# Altium schematic sheet praline.SchDoc
size 297 x 209 mm
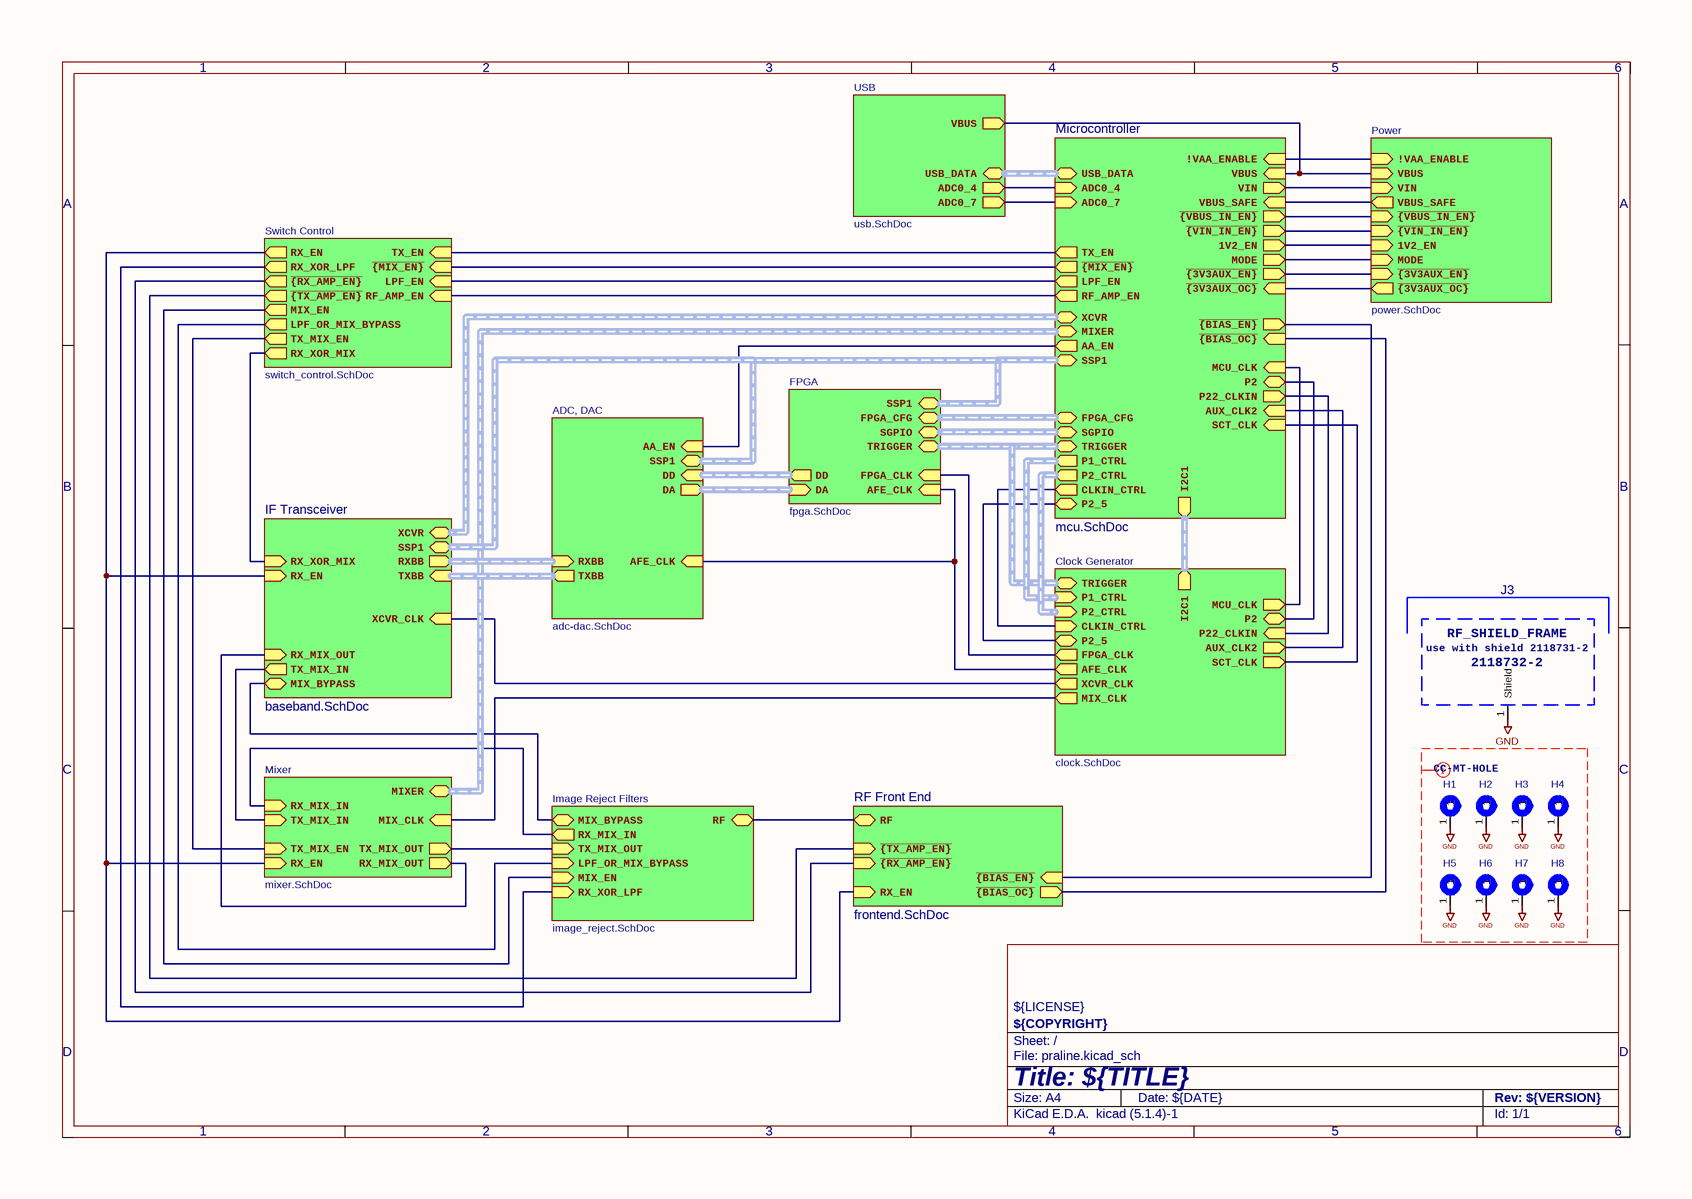
[diagram p0: praline.SchDoc]

## Parts
H1  MountingHole_Pad  [MountingHole_3.2mm_M3_Pad_Via]  (value not drawn)
H2  MountingHole_Pad  [MountingHole_3.2mm_M3_Pad_Via]  (value not drawn)
H3  MountingHole_Pad  [MountingHole_3.2mm_M3_Pad_Via]  (value not drawn)
H4  MountingHole_Pad  [MountingHole_3.2mm_M3_Pad_Via]  (value not drawn)
H5  MountingHole_Pad  [MountingHole_2.2mm_M2_Pad_Via]  (value not drawn)
H6  MountingHole_Pad  [MountingHole_2.2mm_M2_Pad_Via]  (value not drawn)
H7  MountingHole_Pad  [MountingHole_2.2mm_M2_Pad_Via]  (value not drawn)
H8  MountingHole_Pad  [MountingHole_2.2mm_M2_Pad_Via]  (value not drawn)
J3  Part Number: 2118732-2  Note: use with shield 2118731-2  [Laird_Technologies_BMI-S-230-F_50.8x38.1mm]  (hidden comment: RF_SHIELD_FRAME)

## Sub-sheets
ADC, DAC = adc-dac.SchDoc: AFE_CLK (in), RXBB (in, harness RXBB), TXBB (out, harness TXBB), DD (in, harness DD), DA (out, harness DA), AA_EN (in), SSP1 (bidir, harness SSP1)
Clock Generator = clock.SchDoc: MCU_CLK (out), AFE_CLK (out), MIX_CLK (out), XCVR_CLK (out), TRIGGER (bidir, harness TRIGGER), SCT_CLK (out), FPGA_CLK (out), P2_5 (bidir), AUX_CLK2 (out), P1_CTRL (in, harness P1_CTRL), P22_CLKIN (in), P2_CTRL (in, harness P2_CTRL), P2 (bidir), CLKIN_CTRL (in), I2C1 (out, harness I2C1)
FPGA = fpga.SchDoc: DD (out, harness DD), DA (in, harness DA), AFE_CLK (in), FPGA_CLK (in), TRIGGER (bidir, harness TRIGGER), SGPIO (bidir, harness SGPIO), FPGA_CFG (bidir, harness FPGA_CFG), SSP1 (bidir, harness SSP1)
IF Transceiver = baseband.SchDoc: TXBB (in, harness TXBB), RXBB (out, harness RXBB), XCVR_CLK (in), RX_XOR_MIX (in), RX_EN (in), MIX_BYPASS (bidir), TX_MIX_IN (out), RX_MIX_OUT (in), SSP1 (bidir, harness SSP1), XCVR (bidir, harness XCVR)
Image Reject Filters = image_reject.SchDoc: RX_MIX_IN (out), TX_MIX_OUT (in), MIX_BYPASS (bidir), RX_XOR_LPF (in), MIX_EN (in), LPF_OR_MIX_BYPASS (in), RF (bidir)
Microcontroller = mcu.SchDoc: MCU_CLK (in), 1V2_EN (out), VIN (out), VBUS_SAFE (in), ~{{VBUS_IN_EN}} (out), ~{{VIN_IN_EN}} (out), MODE (out), LPF_EN (out), RF_AMP_EN (out), TX_EN (out), ~{{MIX_EN}} (out), ~{{BIAS_EN}} (out), ~{{BIAS_OC}} (in), ~{{3V3AUX_EN}} (out), ~{{3V3AUX_OC}} (in), VBUS (in), USB_DATA (bidir, harness USB_DATA), XCVR (bidir, harness XCVR), SCT_CLK (in), MIXER (bidir, harness MIXER), AA_EN (out), AUX_CLK2 (in), P22_CLKIN (out), P2 (bidir), ADC0_4 (in), ADC0_7 (in), P2_5 (bidir), CLKIN_CTRL (out), P2_CTRL (out, harness P2_CTRL), P1_CTRL (out, harness P1_CTRL), TRIGGER (bidir, harness TRIGGER), SGPIO (bidir, harness SGPIO), FPGA_CFG (bidir, harness FPGA_CFG), SSP1 (bidir, harness SSP1), !VAA_ENABLE (in), I2C1 (out, harness I2C1)
Mixer = mixer.SchDoc: MIX_CLK (in), RX_EN (in), RX_MIX_IN (in), TX_MIX_IN (in), RX_MIX_OUT (out), TX_MIX_OUT (out), MIXER (bidir, harness MIXER), TX_MIX_EN (in)
Power = power.SchDoc: 1V2_EN (in), ~{{VBUS_IN_EN}} (in), VBUS (in), MODE (in), ~{{VIN_IN_EN}} (in), VIN (in), VBUS_SAFE (out), ~{{3V3AUX_EN}} (in), ~{{3V3AUX_OC}} (out), !VAA_ENABLE (in)
RF Front End = frontend.SchDoc: ~{{TX_AMP_EN}} (in), ~{{BIAS_OC}} (out), ~{{RX_AMP_EN}} (in), ~{{BIAS_EN}} (in), RX_EN (in), RF (bidir)
Switch Control = switch_control.SchDoc: TX_EN (in), RX_EN (out), MIX_EN (out), RF_AMP_EN (in), LPF_EN (in), ~{{MIX_EN}} (in), RX_XOR_MIX (out), RX_XOR_LPF (out), ~{{TX_AMP_EN}} (out), ~{{RX_AMP_EN}} (out), LPF_OR_MIX_BYPASS (out), TX_MIX_EN (out)
USB = usb.SchDoc: VBUS (out), USB_DATA (bidir, harness USB_DATA), ADC0_4 (out), ADC0_7 (out)

## Nets
GND: H1.1 H2.1 H3.1 H4.1 H5.1 H6.1 H7.1 H8.1 J3.1(Shield)
(unnamed): sheet Microcontroller/MCU_CLK, sheet Clock Generator/MCU_CLK
(unnamed): sheet Microcontroller/1V2_EN, sheet Power/1V2_EN
(unnamed): sheet Microcontroller/VIN, sheet Power/VIN
(unnamed): sheet Microcontroller/VBUS_SAFE, sheet Power/VBUS_SAFE
(unnamed): sheet Microcontroller/~{{VBUS_IN_EN}}, sheet Power/~{{VBUS_IN_EN}}
(unnamed): sheet Microcontroller/~{{VIN_IN_EN}}, sheet Power/~{{VIN_IN_EN}}
(unnamed): sheet Microcontroller/MODE, sheet Power/MODE
(unnamed): sheet Microcontroller/LPF_EN, sheet Switch Control/LPF_EN
(unnamed): sheet Microcontroller/RF_AMP_EN, sheet Switch Control/RF_AMP_EN
(unnamed): sheet Microcontroller/TX_EN, sheet Switch Control/TX_EN
(unnamed): sheet Microcontroller/~{{MIX_EN}}, sheet Switch Control/~{{MIX_EN}}
(unnamed): sheet Microcontroller/~{{BIAS_EN}}, sheet RF Front End/~{{BIAS_EN}}
(unnamed): sheet Microcontroller/~{{BIAS_OC}}, sheet RF Front End/~{{BIAS_OC}}
(unnamed): sheet Microcontroller/~{{3V3AUX_EN}}, sheet Power/~{{3V3AUX_EN}}
(unnamed): sheet Microcontroller/~{{3V3AUX_OC}}, sheet Power/~{{3V3AUX_OC}}
(unnamed): sheet Microcontroller/VBUS, sheet Power/VBUS, sheet USB/VBUS
(unnamed): sheet Microcontroller/SCT_CLK, sheet Clock Generator/SCT_CLK
(unnamed): sheet Microcontroller/AA_EN, sheet ADC, DAC/AA_EN
(unnamed): sheet Microcontroller/AUX_CLK2, sheet Clock Generator/AUX_CLK2
(unnamed): sheet Microcontroller/P22_CLKIN, sheet Clock Generator/P22_CLKIN
(unnamed): sheet Microcontroller/P2, sheet Clock Generator/P2
(unnamed): sheet Microcontroller/ADC0_4, sheet USB/ADC0_4
(unnamed): sheet Microcontroller/ADC0_7, sheet USB/ADC0_7
(unnamed): sheet Microcontroller/P2_5, sheet Clock Generator/P2_5
(unnamed): sheet Microcontroller/CLKIN_CTRL, sheet Clock Generator/CLKIN_CTRL
(unnamed): sheet Microcontroller/!VAA_ENABLE, sheet Power/!VAA_ENABLE
(unnamed): sheet IF Transceiver/XCVR_CLK, sheet Clock Generator/XCVR_CLK
(unnamed): sheet IF Transceiver/RX_XOR_MIX, sheet Switch Control/RX_XOR_MIX
(unnamed): sheet IF Transceiver/RX_EN, sheet RF Front End/RX_EN, sheet Mixer/RX_EN, sheet Switch Control/RX_EN
(unnamed): sheet IF Transceiver/MIX_BYPASS, sheet Image Reject Filters/MIX_BYPASS
(unnamed): sheet IF Transceiver/TX_MIX_IN, sheet Mixer/TX_MIX_IN
(unnamed): sheet IF Transceiver/RX_MIX_OUT, sheet Mixer/RX_MIX_OUT
(unnamed): sheet RF Front End/~{{TX_AMP_EN}}, sheet Switch Control/~{{TX_AMP_EN}}
(unnamed): sheet RF Front End/~{{RX_AMP_EN}}, sheet Switch Control/~{{RX_AMP_EN}}
(unnamed): sheet RF Front End/RF, sheet Image Reject Filters/RF
(unnamed): sheet ADC, DAC/AFE_CLK, sheet Clock Generator/AFE_CLK, sheet FPGA/AFE_CLK
(unnamed): sheet Mixer/MIX_CLK, sheet Clock Generator/MIX_CLK
(unnamed): sheet Mixer/RX_MIX_IN, sheet Image Reject Filters/RX_MIX_IN
(unnamed): sheet Mixer/TX_MIX_OUT, sheet Image Reject Filters/TX_MIX_OUT
(unnamed): sheet Mixer/TX_MIX_EN, sheet Switch Control/TX_MIX_EN
(unnamed): sheet Clock Generator/FPGA_CLK, sheet FPGA/FPGA_CLK
(unnamed): sheet Switch Control/MIX_EN, sheet Image Reject Filters/MIX_EN
(unnamed): sheet Switch Control/RX_XOR_LPF, sheet Image Reject Filters/RX_XOR_LPF
(unnamed): sheet Switch Control/LPF_OR_MIX_BYPASS, sheet Image Reject Filters/LPF_OR_MIX_BYPASS

## Buses and harness runs
harness sheet ADC, DAC/DA = sheet FPGA/DA
harness sheet ADC, DAC/DD = sheet FPGA/DD
harness sheet ADC, DAC/RXBB = sheet IF Transceiver/RXBB
harness sheet ADC, DAC/SSP1 = sheet FPGA/SSP1 = sheet IF Transceiver/SSP1 = sheet Microcontroller/SSP1
harness sheet ADC, DAC/TXBB = sheet IF Transceiver/TXBB
harness sheet Clock Generator/I2C1 = sheet Microcontroller/I2C1
harness sheet Clock Generator/P1_CTRL = sheet Microcontroller/P1_CTRL
harness sheet Clock Generator/P2_CTRL = sheet Microcontroller/P2_CTRL
harness sheet Clock Generator/TRIGGER = sheet FPGA/TRIGGER = sheet Microcontroller/TRIGGER
harness sheet FPGA/FPGA_CFG = sheet Microcontroller/FPGA_CFG
harness sheet FPGA/SGPIO = sheet Microcontroller/SGPIO
harness sheet IF Transceiver/XCVR = sheet Microcontroller/XCVR
harness sheet Microcontroller/MIXER = sheet Mixer/MIXER
harness sheet Microcontroller/USB_DATA = sheet USB/USB_DATA

## Layout directives
CompClassName: CC-MT-HOLE: GND

## Notes on the sheet
- 1
- 2
- 3
- 4
- 5
- 6
- A
- B
- C
- ${LICENSE}
- D
- Title: ${TITLE}
- File: praline.kicad_sch
- Sheet: /
- ${COPYRIGHT}
- KiCad E.D.A.  kicad (5.1.4)-1
- Size: A4
- Date: ${DATE}
- Rev: ${VERSION}
- Id: 1/1

## Library data of the parts
J3 = RFShield_TwoPieces: Manufacturer: TE Connectivity; Value: RF_SHIELD_FRAME; Footprint: praline:Laird_Technologies_BMI-S-230-F_50.8x38.1mm
H1-H8 = MountingHole_Pad: Value: MountingHole_Pad
  H1-H4: Footprint: praline:MountingHole_3.2mm_M3_Pad_Via
  H5-H8: Footprint: MountingHole:MountingHole_2.2mm_M2_Pad_Via